# Altium schematic sheet golgi_bot_ESP_V2.01.SchDoc
size 394 x 156 mm; SheetNumber: 1; SheetTotal: 1
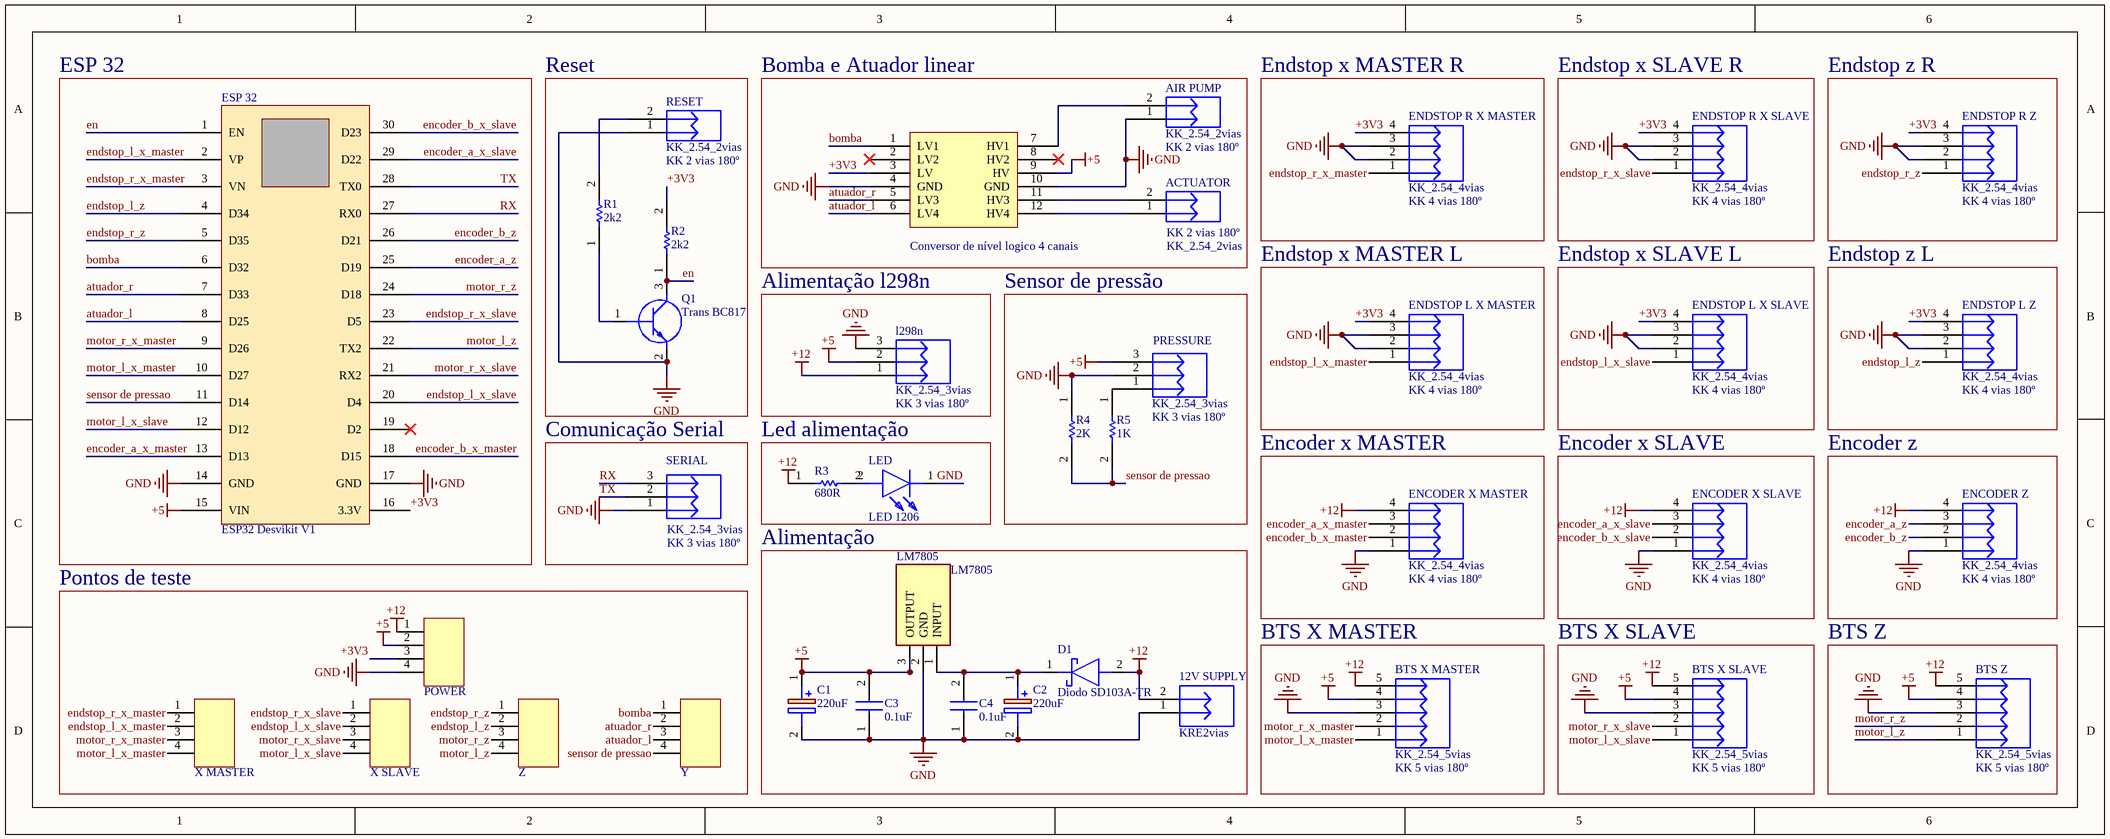
[diagram p0: golgi_bot_ESP_V2.01.SchDoc]

## Parts
12V_SUPPLY  KRE2vias  [KRE2-2vias]
?  Conversor de nível logico 4 canais  [Conversor de nível lógico 4 canais]
ACTUATOR  KK_2.54_2vias  Valor: KK 2 vias 180º  [KK_2VIAS_180º]
AIR_PUMP  KK_2.54_2vias  Valor: KK 2 vias 180º  [KK_2VIAS_180º]
BTS_X_MASTER  KK_2.54_5vias  Valor: KK 5 vias 180º  [KK_5vias_180°]
BTS_X_SLAVE  KK_2.54_5vias  Valor: KK 5 vias 180º  [KK_5vias_180°]
BTS_Z  KK_2.54_5vias  Valor: KK 5 vias 180º  [KK_5vias_180°]
C1  220uF  [CAPPRD200W55D500H1200]
C2  220uF  [CAPPRD200W55D500H1200]
C3  0.1uF  [CAPC3216X180N]
C4  0.1uF  [CAPC3216X180N]
D1  Diodo SD103A-TR  [DIOAD950W60L350D150]
ENCODER_X_MASTER  KK_2.54_4vias  Valor: KK 4 vias 180º  [KK_4vias_180°]
ENCODER_X_SLAVE  KK_2.54_4vias  Valor: KK 4 vias 180º  [KK_4vias_180°]
ENCODER_Z  KK_2.54_4vias  Valor: KK 4 vias 180º  [KK_4vias_180°]
ENDSTOP_L_X_MASTER  KK_2.54_4vias  Valor: KK 4 vias 180º  [KK_4vias_180°]
ENDSTOP_L_X_SLAVE  KK_2.54_4vias  Valor: KK 4 vias 180º  [KK_4vias_180°]
ENDSTOP_L_Z  KK_2.54_4vias  Valor: KK 4 vias 180º  [KK_4vias_180°]
ENDSTOP_R_X_MASTER  KK_2.54_4vias  Valor: KK 4 vias 180º  [KK_4vias_180°]
ENDSTOP_R_X_SLAVE  KK_2.54_4vias  Valor: KK 4 vias 180º  [KK_4vias_180°]
ENDSTOP_R_Z  KK_2.54_4vias  Valor: KK 4 vias 180º  [KK_4vias_180°]
ESP_32  value ESP32 Desvikit V1  [ESP32_Desvikit_v1]  (hidden comment: microcontrolador)
l298n  KK_2.54_3vias  Valor: KK 3 vias 180º  [KK_3vias_180º]
LED  LED 1206  [LEDC3214X78N]
LM7805  LM7805  [TO255P460X1020X2008-3P]
POWER  Testing PADS 1x4  [Testing PADS 1x4]  (value not drawn)
PRESSURE  KK_2.54_3vias  Valor: KK 3 vias 180º  [KK_3vias_180º]
Q1  Trans BC817  [SOT96P240X110-3N]
R1  2k2  [RESC3216X60N]
R2  2k2  [RESC3216X60N]
R3  680R  [RESC3216X60N]
R4  2K  [RESC3216X60N]
R5  1K  [RESC3216X60N]
RESET  KK_2.54_2vias  Valor: KK 2 vias 180º  [KK_2VIAS_180º]
SERIAL  KK_2.54_3vias  Valor: KK 3 vias 180º  [KK_3vias_180º]
X_MASTER  Testing PADS 1x4  [Testing PADS 1x4]  (value not drawn)
X_SLAVE  Testing PADS 1x4  [Testing PADS 1x4]  (value not drawn)
Y  Testing PADS 1x4  [Testing PADS 1x4]  (value not drawn)
Z  Testing PADS 1x4  [Testing PADS 1x4]  (value not drawn)

## Blocks framed on the sheet
ESP 32: ESP_32
Reset: Q1 R1 R2 RESET
Bomba e Atuador linear: ? ACTUATOR AIR_PUMP
Endstop x MASTER R: ENDSTOP_R_X_MASTER
Endstop x SLAVE R: ENDSTOP_R_X_SLAVE
Endstop z R: ENDSTOP_R_Z
Alimentação l298n: l298n
Sensor de pressão: PRESSURE R4 R5
Endstop x MASTER L: ENDSTOP_L_X_MASTER
Endstop x SLAVE L: ENDSTOP_L_X_SLAVE
Endstop z L: ENDSTOP_L_Z
Comunicação Serial: SERIAL
Led alimentação: LED R3
Encoder x MASTER: ENCODER_X_MASTER
Encoder x SLAVE: ENCODER_X_SLAVE
Encoder z: ENCODER_Z
Alimentação: 12V_SUPPLY C1-C4 D1 LM7805
Pontos de teste: POWER X_MASTER X_SLAVE Y Z
BTS X MASTER: BTS_X_MASTER
BTS X SLAVE: BTS_X_SLAVE
BTS Z: BTS_Z

## Nets
+5: ?.9(HV) BTS_X_MASTER.4 BTS_X_SLAVE.4 BTS_Z.4 C1.1(+) C3.2 ESP_32.15(VIN) l298n.2 LM7805.3(OUTPUT) POWER.2 PRESSURE.3
+12: 12V_SUPPLY.2 BTS_X_MASTER.5 BTS_X_SLAVE.5 BTS_Z.5 D1.2(A) ENCODER_X_MASTER.4 ENCODER_X_SLAVE.4 ENCODER_Z.4 l298n.1 POWER.1 R3.1
GND: 12V_SUPPLY.1 ?.4(GND) ?.10(GND) AIR_PUMP.1 BTS_X_MASTER.3 BTS_X_SLAVE.3 BTS_Z.3 C1.2(-) C2.2(-) C3.1 C4.1 ENCODER_X_MASTER.1 ENCODER_X_SLAVE.1 ENCODER_Z.1 ENDSTOP_L_X_MASTER.2 ENDSTOP_L_X_MASTER.3 ENDSTOP_L_X_SLAVE.2 ENDSTOP_L_X_SLAVE.3 ENDSTOP_L_Z.2 ENDSTOP_L_Z.3 ENDSTOP_R_X_MASTER.2 ENDSTOP_R_X_MASTER.3 ENDSTOP_R_X_SLAVE.2 ENDSTOP_R_X_SLAVE.3 ENDSTOP_R_Z.2 ENDSTOP_R_Z.3 ESP_32.14(GND) ESP_32.17(GND) l298n.3 LED.1(K) LM7805.2(GND) POWER.4 PRESSURE.2 Q1.2(E) R4.1 RESET.1 SERIAL.1
+3V3: ?.3(LV) ENDSTOP_L_X_MASTER.4 ENDSTOP_L_X_SLAVE.4 ENDSTOP_L_Z.4 ENDSTOP_R_X_MASTER.4 ENDSTOP_R_X_SLAVE.4 ENDSTOP_R_Z.4 ESP_32.16(3.3V) POWER.3 R2.2
atuador_l: ?.6(LV4) ESP_32.8(D25) Y.3
atuador_r: ?.5(LV3) ESP_32.7(D33) Y.2
bomba: ?.1(LV1) ESP_32.6(D32) Y.1
en: ESP_32.1(EN) Q1.3(C) R2.1
encoder_a_x_master: ENCODER_X_MASTER.3 ESP_32.13(D13)
encoder_a_x_slave: ENCODER_X_SLAVE.3 ESP_32.29(D22)
encoder_a_z: ENCODER_Z.3 ESP_32.25(D19)
encoder_b_x_master: ENCODER_X_MASTER.2 ESP_32.18(D15)
encoder_b_x_slave: ENCODER_X_SLAVE.2 ESP_32.30(D23)
encoder_b_z: ENCODER_Z.2 ESP_32.26(D21)
endstop_l_x_master: ENDSTOP_L_X_MASTER.1 ESP_32.2(VP) X_MASTER.2
endstop_l_x_slave: ENDSTOP_L_X_SLAVE.1 ESP_32.20(D4) X_SLAVE.2
endstop_l_z: ENDSTOP_L_Z.1 ESP_32.4(D34) Z.2
endstop_r_x_master: ENDSTOP_R_X_MASTER.1 ESP_32.3(VN) X_MASTER.1
endstop_r_x_slave: ENDSTOP_R_X_SLAVE.1 ESP_32.23(D5) X_SLAVE.1
endstop_r_z: ENDSTOP_R_Z.1 ESP_32.5(D35) Z.1
motor_l_x_master: BTS_X_MASTER.1 ESP_32.10(D27) X_MASTER.4
motor_l_x_slave: BTS_X_SLAVE.1 ESP_32.12(D12) X_SLAVE.4
motor_l_z: BTS_Z.1 ESP_32.22(TX2) Z.4
motor_r_x_master: BTS_X_MASTER.2 ESP_32.9(D26) X_MASTER.3
motor_r_x_slave: BTS_X_SLAVE.2 ESP_32.21(RX2) X_SLAVE.3
motor_r_z: BTS_Z.2 ESP_32.24(D18) Z.3
RX: ESP_32.27(RX0) SERIAL.3
sensor de pressao: ESP_32.11(D14) R4.2 R5.2 Y.4
TX: ESP_32.28(TX0) SERIAL.2
Net?_7: ?.7(HV1) AIR_PUMP.2
Net?_11: ?.11(HV3) ACTUATOR.2
Net?_12: ?.12(HV4) ACTUATOR.1
NetC2_1: C2.1(+) C4.2 D1.1(K) LM7805.1(INPUT)
NetLED_2: LED.2(A) R3.2
NetPRESSURE_1: PRESSURE.1 R5.1
NetQ1_1: Q1.1(B) R1.1
NetR1_2: R1.2 RESET.2

Not connected (* = marked no-connect by the designer): ? 2(LV2)* 8(HV2)*; ESP_32 19(D2)*

## Library data of the parts
12V_SUPPLY = KRE2vias: Conector 2 vias; Descrição: Conector KRE 2 vias 180º; Encapsulamento: PTH - 180º; Modelo: 2 vias - 180º; Marca: *; Observação: *
ACTUATOR AIR_PUMP RESET = KK_2.54_2vias: Conector KK 2.54mm 2 vias; Descrição: Conector KK 3 vias com passo 2.54mm; Encapsulamento: PTH - 180º; Modelo: 2 vias - 180º; Marca: *; Observação: *
BTS_X_MASTER BTS_X_SLAVE BTS_Z = KK_2.54_5vias: Conector KK 2.54mm 5 vias; Descrição: Conector KK 3 vias com passo 2.54mm; Encapsulamento: PTH - 180º; Modelo: 3 vias - 180º; Marca: *; Observação: *
C1 C2 = Capacitor eletrolítico D5mm: Capacitor Polarised; Manufacturer_Name: Panasonic; Manufacturer_Part_Number: ECA-0JM221; Datasheet Link: http://industrial.panasonic.com/cdbs/www-data/pdf/RDF0000/ABA0000C1218.pdf; Height: 12mm; Mouser Part Number: 667-ECA-0JM221; Mouser Price/Stock: https://www.mouser.com/Search/Refine.aspx?Keyword=667-ECA-0JM221; Arrow Part Number: ECA-0JM221; Arrow Price/Stock: https://www.arrow.com/en/products/eca-0jm221/panasonic
C3 C4 = Capacitor Cerâmico 1206: Capacitor; Manufacturer_Name: TDK; Manufacturer_Part_Number: C3216X5R0J226M160AA; Datasheet Link: https://product.tdk.com/info/en/catalog/datasheets/mlcc_commercial_midvoltage_en.pdf; Height: 1.8mm; Mouser Part Number: 810-C3216X5R0J226M-6; Mouser Price/Stock: https://www.mouser.com/Search/Refine.aspx?Keyword=810-C3216X5R0J226M-6
D1 = Diodo SD103A-TR: Schottky Diode; Manufacturer_Name: Vishay; Datasheet Link: https://componentsearchengine.com/Datasheets/5/SD103A-TR.pdf; Manufacturer_Part_Number: SD103A-TR; Mouser Part Number: 625-SD103A; Mouser Price/Stock: https://www.mouser.co.uk/ProductDetail/Vishay-Semiconductors/SD103A-TR?qs=RwahMLkpD2urFD%2FzZdGOBw%3D%3D; Arrow Part Number: SD103A-TR; Arrow Price/Stock: https://www.arrow.com/en/products/sd103a-tr/vishay?region=nac
ENCODER_X_MASTER ENCODER_X_SLAVE ENCODER_Z ENDSTOP_L_X_MASTER ENDSTOP_L_X_SLAVE ENDSTOP_L_Z ENDSTOP_R_X_MASTER ENDSTOP_R_X_SLAVE ENDSTOP_R_Z = KK_2.54_4vias: Conector KK 2.54mm 4 vias; Descrição: Conector KK 3 vias com passo 2.54mm; Encapsulamento: PTH - 180º; Modelo: 3 vias - 180º; Marca: *; Observação: *
ESP_32 = ESP32 Desvikit v1: microcontrolador com moculo bluethoth e wifi
l298n PRESSURE SERIAL = KK_2.54_3vias: Conector KK 2.54mm 3 vias; Descrição: Conector KK 3 vias com passo 2.54mm; Encapsulamento: PTH - 180º; Modelo: 3 vias - 180º; Marca: *; Observação: *
LED = LED 1206: LED; Manufacturer_Name: Wurth Elektronik; Manufacturer_Part_Number: 150120BS75000; Datasheet Link: https://katalog.we-online.de/led/datasheet/150120BS75000.pdf; Height: 0.78mm; Mouser Part Number: 710-150120BS75000; Mouser Price/Stock: https://www.mouser.co.uk/ProductDetail/Wurth-Elektronik/150120BS75000?qs=LlUlMxKIyB1WGHUNBglvng%3D%3D
LM7805 = MC7805CT-BP: Integrated Circuit; Manufacturer_Name: Micro Commercial Components (MCC); Datasheet Link: https://componentsearchengine.com/Datasheets/2/MC7805CT-BP.pdf; Height: 4.82mm; Manufacturer_Part_Number: MC7805CT-BP; Mouser Part Number: 833-MC7805CT-BP; Mouser Price/Stock: https://www.mouser.co.uk/ProductDetail/Micro-Commercial-Components-MCC/MC7805CT-BP?qs=SdqRYZZ9IxChYPR4%2FIgmYA%3D%3D; Arrow Part Number: MC7805CT-BP; Arrow Price/Stock: https://www.arrow.com/en/products/mc7805ct-bp/micro-commercial-components
POWER X_MASTER X_SLAVE Y Z = Testing PADS 1x4: Headers & Wire Housings 40Pin 2mm Spacing Single Row Hdrs, 5pc; Manufacturer: Cromax; Mounting Angle: Vertical; Number of Positions: 40 Position; Supplier 1: -; Manufacturer Part Number: -; RoHS: RoHS Compliant; Category: Headers & Wire Housings; Stock 1: 14; Pricing 1: 1=1.60, 2=0.80 (BRL); Accessory Type: -; Contact Plating: Gold; Contact Type: -; Number of Rows: 1 Row; Product: Headers; Termination Style: Through Hole; Type: Breakaway; Brand: Cromax; Mounting Style: Straight Pin; Pitch: 2 mm; Row Spacing: -; Contact Gender: Pin (Female); Product Category: Accessories; RoHS - Mouser: Y; Minimum Order Quantity: 1; Reeling: False; ComponentLink1URL: -; ComponentLink1Description: -; Supplier Part Number 1: -
Q1 = Trans BC817: Transistor BJT NPN BC817-25-7-F; Manufacturer_Name: Diodes Inc.; Datasheet Link: https://www.diodes.com/assets/Datasheets/ds11107.pdf; Height: 1.1mm; Manufacturer_Part_Number: BC817-25-7-F; Mouser Part Number: 621-BC817-25-7-F; Mouser Price/Stock: https://www.mouser.co.uk/ProductDetail/Diodes-Incorporated/BC817-25-7-F?qs=rGAXPo9uwV0jK0EyLZnqOw%3D%3D; Arrow Part Number: BC817-25-7-F; Arrow Price/Stock: https://www.arrow.com/en/products/bc817-25-7-f/diodes-incorporated
R1-R3 = Resistor 1206: Resistor; Manufacturer_Name: Vishay; Manufacturer_Part_Number: CRCW12064K70FKEA; Datasheet Link: http://docs-emea.rs-online.com/webdocs/13ec/0900766b813ecc08.pdf; Height: 0.6mm; Mouser Part Number: 71-CRCW1206-4.7K-E3; Mouser Price/Stock: https://www.mouser.co.uk/ProductDetail/Vishay-Dale/CRCW12064K70FKEA?qs=1vm4qhDHCvlKJmatsKzyFQ%3D%3D; Arrow Part Number: CRCW12064K70FKEA; Arrow Price/Stock: https://www.arrow.com/en/products/crcw12064k70fkea/vishay
R4 R5 = Resistor 1206: Manufacturer_Name: Vishay; Manufacturer_Part_Number: CRCW12064K70FKEA; Datasheet Link: http://docs-emea.rs-online.com/webdocs/13ec/0900766b813ecc08.pdf; Height: 0.6mm; Mouser Part Number: 71-CRCW1206-4.7K-E3; Mouser Price/Stock: https://www.mouser.co.uk/ProductDetail/Vishay-Dale/CRCW12064K70FKEA?qs=1vm4qhDHCvlKJmatsKzyFQ%3D%3D; Arrow Part Number: CRCW12064K70FKEA; Arrow Price/Stock: https://www.arrow.com/en/products/crcw12064k70fkea/vishay